# EAGLE design loads (EAGLE 6.6.0)
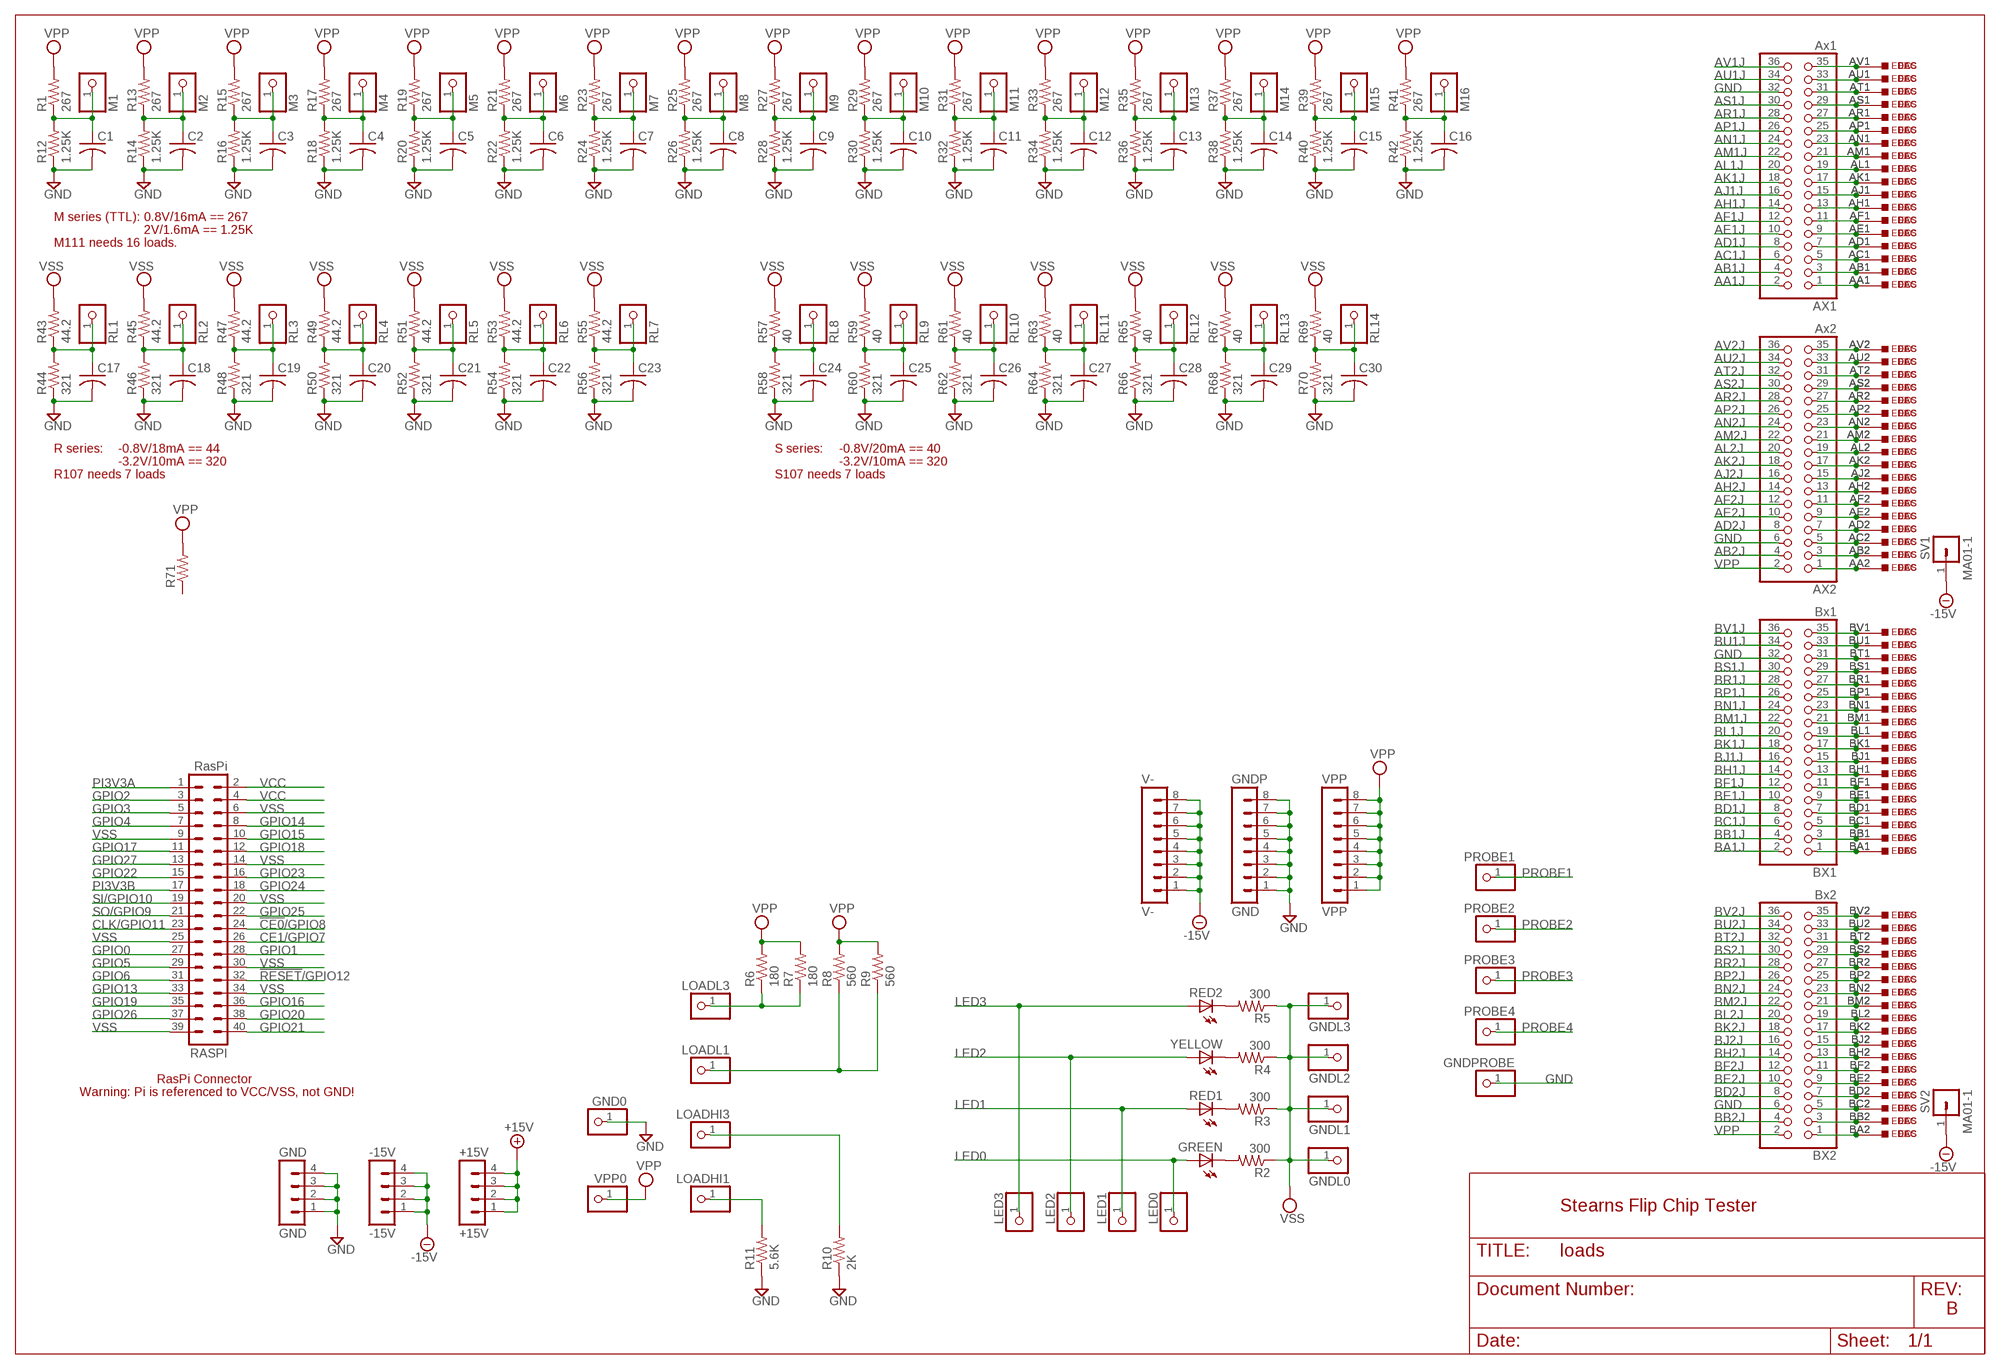
[diagram p0: schematic, sheet 1]

## Parts
+15V  +15V  MA04-1  [MA04-1]
-15V  -15V  MA04-1  [MA04-1]
AX1  Ax1  PINHD-2X18  [2X18]
AX2  Ax2  PINHD-2X18  [2X18]
BX1  Bx1  PINHD-2X18  [2X18]
BX2  Bx2  PINHD-2X18  [2X18]
C1  C-US025-025X050  [C025-025X050]
C2  C-US025-025X050  [C025-025X050]
C3  C-US025-025X050  [C025-025X050]
C4  C-US025-025X050  [C025-025X050]
C5  C-US025-025X050  [C025-025X050]
C6  C-US025-025X050  [C025-025X050]
C7  C-US025-025X050  [C025-025X050]
C8  C-US025-025X050  [C025-025X050]
C9  C-US025-025X050  [C025-025X050]
C10  C-US025-025X050  [C025-025X050]
C11  C-US025-025X050  [C025-025X050]
C12  C-US025-025X050  [C025-025X050]
C13  C-US025-025X050  [C025-025X050]
C14  C-US025-025X050  [C025-025X050]
C15  C-US025-025X050  [C025-025X050]
C16  C-US025-025X050  [C025-025X050]
C17  C-US025-025X050  [C025-025X050]
C18  C-US025-025X050  [C025-025X050]
C19  C-US025-025X050  [C025-025X050]
C20  C-US025-025X050  [C025-025X050]
C21  C-US025-025X050  [C025-025X050]
C22  C-US025-025X050  [C025-025X050]
C23  C-US025-025X050  [C025-025X050]
C24  C-US025-025X050  [C025-025X050]
C25  C-US025-025X050  [C025-025X050]
C26  C-US025-025X050  [C025-025X050]
C27  C-US025-025X050  [C025-025X050]
C28  C-US025-025X050  [C025-025X050]
C29  C-US025-025X050  [C025-025X050]
C30  C-US025-025X050  [C025-025X050]
DEC  W971  [H807-2]
ECS  W971ECS  [ECS2418-2]
EDAC  W971EDAC  [EDAC346-36-2]
GND  GND  MA04-1  [MA04-1]
GND0  PINHD-1X1  [1X01]
GNDL0  PINHD-1X1  [1X01]
GNDL1  PINHD-1X1  [1X01]
GNDL2  PINHD-1X1  [1X01]
GNDL3  PINHD-1X1  [1X01]
GNDP  GND  MA08-1  [MA08-1]
GNDPROBE  PINHD-1X1  [1X01]
GREEN  LED5MM  [LED5MM]
LED0  PINHD-1X1  [1X01]
LED1  PINHD-1X1  [1X01]
LED2  PINHD-1X1  [1X01]
LED3  PINHD-1X1  [1X01]
LOADHI1  PINHD-1X1  [1X01]
LOADHI3  PINHD-1X1  [1X01]
LOADL1  PINHD-1X1  [1X01]
LOADL3  PINHD-1X1  [1X01]
M1  PINHD-1X1  [1X01]
M2  PINHD-1X1  [1X01]
M3  PINHD-1X1  [1X01]
M4  PINHD-1X1  [1X01]
M5  PINHD-1X1  [1X01]
M6  PINHD-1X1  [1X01]
M7  PINHD-1X1  [1X01]
M8  PINHD-1X1  [1X01]
M9  PINHD-1X1  [1X01]
M10  PINHD-1X1  [1X01]
M11  PINHD-1X1  [1X01]
M12  PINHD-1X1  [1X01]
M13  PINHD-1X1  [1X01]
M14  PINHD-1X1  [1X01]
M15  PINHD-1X1  [1X01]
M16  PINHD-1X1  [1X01]
PROBE1  PINHD-1X1  [1X01]
PROBE2  PINHD-1X1  [1X01]
PROBE3  PINHD-1X1  [1X01]
PROBE4  PINHD-1X1  [1X01]
R1  267  R-US_0207/10  [0207/10]
R2  300  R-US_0207/10  [0207/10]
R3  300  R-US_0207/10  [0207/10]
R4  300  R-US_0207/10  [0207/10]
R5  300  R-US_0207/10  [0207/10]
R6  180  R-US_0207/10  [0207/10]
R7  180  R-US_0207/10  [0207/10]
R8  560  R-US_0207/10  [0207/10]
R9  560  R-US_0207/10  [0207/10]
R10  2K  R-US_0207/10  [0207/10]
R11  5.6K  R-US_0207/10  [0207/10]
R12  1.25K  R-US_0207/10  [0207/10]
R13  267  R-US_0207/10  [0207/10]
R14  1.25K  R-US_0207/10  [0207/10]
R15  267  R-US_0207/10  [0207/10]
R16  1.25K  R-US_0207/10  [0207/10]
R17  267  R-US_0207/10  [0207/10]
R18  1.25K  R-US_0207/10  [0207/10]
R19  267  R-US_0207/10  [0207/10]
R20  1.25K  R-US_0207/10  [0207/10]
R21  267  R-US_0207/10  [0207/10]
R22  1.25K  R-US_0207/10  [0207/10]
R23  267  R-US_0207/10  [0207/10]
R24  1.25K  R-US_0207/10  [0207/10]
R25  267  R-US_0207/10  [0207/10]
R26  1.25K  R-US_0207/10  [0207/10]
R27  267  R-US_0207/10  [0207/10]
R28  1.25K  R-US_0207/10  [0207/10]
R29  267  R-US_0207/10  [0207/10]
R30  1.25K  R-US_0207/10  [0207/10]
R31  267  R-US_0207/10  [0207/10]
R32  1.25K  R-US_0207/10  [0207/10]
R33  267  R-US_0207/10  [0207/10]
R34  1.25K  R-US_0207/10  [0207/10]
R35  267  R-US_0207/10  [0207/10]
R36  1.25K  R-US_0207/10  [0207/10]
R37  267  R-US_0207/10  [0207/10]
R38  1.25K  R-US_0207/10  [0207/10]
R39  267  R-US_0207/10  [0207/10]
R40  1.25K  R-US_0207/10  [0207/10]
R41  267  R-US_0207/10  [0207/10]
R42  1.25K  R-US_0207/10  [0207/10]
R43  44.2  R-US_0207/10  [0207/10]
R44  321  R-US_0207/10  [0207/10]
R45  44.2  R-US_0207/10  [0207/10]
R46  321  R-US_0207/10  [0207/10]
R47  44.2  R-US_0207/10  [0207/10]
R48  321  R-US_0207/10  [0207/10]
R49  44.2  R-US_0207/10  [0207/10]
R50  321  R-US_0207/10  [0207/10]
R51  44.2  R-US_0207/10  [0207/10]
R52  321  R-US_0207/10  [0207/10]
R53  44.2  R-US_0207/10  [0207/10]
R54  321  R-US_0207/10  [0207/10]
R55  44.2  R-US_0207/10  [0207/10]
R56  321  R-US_0207/10  [0207/10]
R57  40  R-US_0207/10  [0207/10]
R58  321  R-US_0207/10  [0207/10]
R59  40  R-US_0207/10  [0207/10]
R60  321  R-US_0207/10  [0207/10]
R61  40  R-US_0207/10  [0207/10]
R62  321  R-US_0207/10  [0207/10]
R63  40  R-US_0207/10  [0207/10]
R64  321  R-US_0207/10  [0207/10]
R65  40  R-US_0207/10  [0207/10]
R66  321  R-US_0207/10  [0207/10]
R67  40  R-US_0207/10  [0207/10]
R68  321  R-US_0207/10  [0207/10]
R69  40  R-US_0207/10  [0207/10]
R70  321  R-US_0207/10  [0207/10]
R71  R-US_0207/10  [0207/10]
RASPI  RasPi  MA20-2  [MA20-2]
RED1  LED5MM  [LED5MM]
RED2  LED5MM  [LED5MM]
RL1  PINHD-1X1  [1X01]
RL2  PINHD-1X1  [1X01]
RL3  PINHD-1X1  [1X01]
RL4  PINHD-1X1  [1X01]
RL5  PINHD-1X1  [1X01]
RL6  PINHD-1X1  [1X01]
RL7  PINHD-1X1  [1X01]
RL8  PINHD-1X1  [1X01]
RL9  PINHD-1X1  [1X01]
RL10  PINHD-1X1  [1X01]
RL11  PINHD-1X1  [1X01]
RL12  PINHD-1X1  [1X01]
RL13  PINHD-1X1  [1X01]
RL14  PINHD-1X1  [1X01]
SV1  MA01-1  [MA01-1]
SV2  MA01-1  [MA01-1]
V-  V-  MA08-1  [MA08-1]
VPP  VPP  MA08-1  [MA08-1]
VPP0  PINHD-1X1  [1X01]
YELLOW  LED5MM  [LED5MM]

## Nets
!CE0!/GPIO8: RASPI.24
!RESET!/GPIO12: RASPI.32
+15V [Supply]: +15V.1 +15V.2 +15V.3 +15V.4
-15V [Supply]: -15V.1 -15V.2 -15V.3 -15V.4 SV1.1 SV2.1 V-.1 V-.2 V-.3 V-.4 V-.5 V-.6 V-.7 V-.8
AA1J: AX1.2
AB1J: AX1.4
AB2J [Supply]: AX2.4
AC1J: AX1.6
AD1J: AX1.8
AD2J: AX2.8
AE1J: AX1.10
AE2J: AX2.10
AF1J: AX1.12
AF2J: AX2.12
AH1J: AX1.14
AH2J: AX2.14
AJ1J: AX1.16
AJ2J: AX2.16
AK1J: AX1.18
AK2J: AX2.18
AL1J: AX1.20
AL2J: AX2.20
AM1J: AX1.22
AM2J: AX2.22
AN1J: AX1.24
AN2J: AX2.24
AP1J: AX1.26
AP2J: AX2.26
AR1J: AX1.28
AR2J: AX2.28
AS1J: AX1.30
AS2J: AX2.30
AT2J: AX2.32
AU1J: AX1.34
AU2J: AX2.34
AV1J: AX1.36
AV2J: AX2.36
BA1J: BX1.2
BB1J: BX1.4
BB2J: BX2.4
BC1J: BX1.6
BD1J: BX1.8
BD2J: BX2.8
BE1J: BX1.10
BE2J: BX2.10
BF1J: BX1.12
BF2J: BX2.12
BH1J: BX1.14
BH2J: BX2.14
BJ1J: BX1.16
BJ2J: BX2.16
BK1J: BX1.18
BK2J: BX2.18
BL1J: BX1.20
BL2J: BX2.20
BM1J: BX1.22
BM2J: BX2.22
BN1J: BX1.24
BN2J: BX2.24
BP1J: BX1.26
BP2J: BX2.26
BR1J: BX1.28
BR2J: BX2.28
BS1J: BX1.30
BS2J: BX2.30
BT2J: BX2.32
BU1J: BX1.34
BU2J: BX2.34
BV1J: BX1.36
BV2J: BX2.36
CE1/GPIO7: RASPI.26
CLK/GPIO11: RASPI.23
GND [Supply]: AX1.32 AX2.6 BX1.32 BX2.6 C1.2 C2.2 C3.2 C4.2 C5.2 C6.2 C7.2 C8.2 C9.2 C10.2 C11.2 C12.2 C13.2 C14.2 C15.2 C16.2 C17.2 C18.2 C19.2 C20.2 C21.2 C22.2 C23.2 C24.2 C25.2 C26.2 C27.2 C28.2 C29.2 C30.2 GND0.1 GND.1 GND.2 GND.3 GND.4 GNDP.1 GNDP.2 GNDP.3 GNDP.4 GNDP.5 GNDP.6 GNDP.7 GNDP.8 GNDPROBE.1 R10.1 R11.1 R12.1 R14.1 R16.1 R18.1 R20.1 R22.1 R24.1 R26.1 R28.1 R30.1 R32.1 R34.1 R36.1 R38.1 R40.1 R42.1 R44.1 R46.1 R48.1 R50.1 R52.1 R54.1 R56.1 R58.1 R60.1 R62.1 R64.1 R66.1 R68.1 R70.1
GPIO0: RASPI.27
GPIO1: RASPI.28
GPIO2: RASPI.3
GPIO3: RASPI.5
GPIO4: RASPI.7
GPIO5: RASPI.29
GPIO6: RASPI.31
GPIO13: RASPI.33
GPIO14: RASPI.8
GPIO15: RASPI.10
GPIO16: RASPI.36
GPIO17: RASPI.11
GPIO18: RASPI.12
GPIO19: RASPI.35
GPIO20: RASPI.38
GPIO21: RASPI.40
GPIO22: RASPI.15
GPIO23: RASPI.16
GPIO24: RASPI.18
GPIO25: RASPI.22
GPIO26: RASPI.37
GPIO27: RASPI.13
LED0: GREEN.A LED0.1
LED1: LED1.1 RED1.A
LED2: LED2.1 YELLOW.A
LED3: LED3.1 RED2.A
N$1: AX1.1 DEC.AA1 ECS.AA1 EDAC.AA1
N$2: AX1.35 DEC.AV1 ECS.AV1 EDAC.AV1
N$3: AX1.33 DEC.AU1 ECS.AU1 EDAC.AU1
N$4: AX1.31 DEC.AT1 ECS.AT1 EDAC.AT1
N$5: AX1.29 DEC.AS1 ECS.AS1 EDAC.AS1
N$6: AX1.27 DEC.AR1 ECS.AR1 EDAC.AR1
N$7: AX1.25 DEC.AP1 ECS.AP1 EDAC.AP1
N$8: AX1.23 DEC.AN1 ECS.AN1 EDAC.AN1
N$9: AX1.21 DEC.AM1 ECS.AM1 EDAC.AM1
N$10: AX1.19 DEC.AL1 ECS.AL1 EDAC.AL1
N$11: AX1.17 DEC.AK1 ECS.AK1 EDAC.AK1
N$12: AX1.15 DEC.AJ1 ECS.AJ1 EDAC.AJ1
N$13: AX1.13 DEC.AH1 ECS.AH1 EDAC.AH1
N$14: AX1.11 DEC.AF1 ECS.AF1 EDAC.AF1
N$15: AX1.9 DEC.AE1 ECS.AE1 EDAC.AE1
N$16: AX1.7 DEC.AD1 ECS.AD1 EDAC.AD1
N$17: AX1.5 DEC.AC1 ECS.AC1 EDAC.AC1
N$18: AX1.3 DEC.AB1 ECS.AB1 EDAC.AB1
N$19: AX2.1 DEC.AA2 ECS.AA2 EDAC.AA2
N$20: AX2.3 DEC.AB2 ECS.AB2 EDAC.AB2
N$21: AX2.5 DEC.AC2 ECS.AC2 EDAC.AC2
N$22: AX2.7 DEC.AD2 ECS.AD2 EDAC.AD2
N$23: AX2.9 DEC.AE2 ECS.AE2 EDAC.AE2
N$24: AX2.11 DEC.AF2 ECS.AF2 EDAC.AF2
N$25: AX2.13 DEC.AH2 ECS.AH2 EDAC.AH2
N$26: AX2.15 DEC.AJ2 ECS.AJ2 EDAC.AJ2
N$27: AX2.17 DEC.AK2 ECS.AK2 EDAC.AK2
N$28: AX2.19 DEC.AL2 ECS.AL2 EDAC.AL2
N$29: AX2.21 DEC.AM2 ECS.AM2 EDAC.AM2
N$30: AX2.23 DEC.AN2 ECS.AN2 EDAC.AN2
N$31: AX2.25 DEC.AP2 ECS.AP2 EDAC.AP2
N$32: AX2.27 DEC.AR2 ECS.AR2 EDAC.AR2
N$33: AX2.29 DEC.AS2 ECS.AS2 EDAC.AS2
N$34: AX2.31 DEC.AT2 ECS.AT2 EDAC.AT2
N$35: AX2.33 DEC.AU2 ECS.AU2 EDAC.AU2
N$36: AX2.35 DEC.AV2 ECS.AV2 EDAC.AV2
N$37: BX2.1 DEC.BA2 ECS.BA2 EDAC.BA2
N$38: BX2.3 DEC.BB2 ECS.BB2 EDAC.BB2
N$39: BX2.5 DEC.BC2 ECS.BC2 EDAC.BC2
N$40: BX2.7 DEC.BD2 ECS.BD2 EDAC.BD2
N$41: BX2.9 DEC.BE2 ECS.BE2 EDAC.BE2
N$42: BX2.11 DEC.BF2 ECS.BF2 EDAC.BF2
N$43: BX2.13 DEC.BH2 ECS.BH2 EDAC.BH2
N$44: BX2.15 DEC.BJ2 ECS.BJ2 EDAC.BJ2
N$45: BX2.17 DEC.BK2 ECS.BK2 EDAC.BK2
N$46: BX2.19 DEC.BL2 ECS.BL2 EDAC.BL2
N$47: BX2.21 DEC.BM2 ECS.BM2 EDAC.BM2
N$48: BX2.23 DEC.BN2 ECS.BN2 EDAC.BN2
N$49: BX2.25 DEC.BP2 ECS.BP2 EDAC.BP2
N$50: BX2.27 DEC.BR2 ECS.BR2 EDAC.BR2
N$51: BX2.29 DEC.BS2 ECS.BS2 EDAC.BS2
N$52: BX2.31 DEC.BT2 ECS.BT2 EDAC.BT2
N$53: BX2.33 DEC.BU2 ECS.BU2 EDAC.BU2
N$54: BX2.35 DEC.BV2 ECS.BV2 EDAC.BV2
N$55: BX1.1 DEC.BA1 ECS.BA1 EDAC.BA1
N$56: BX1.3 DEC.BB1 ECS.BB1 EDAC.BB1
N$57: BX1.5 DEC.BC1 ECS.BC1 EDAC.BC1
N$58: BX1.7 DEC.BD1 ECS.BD1 EDAC.BD1
N$59: BX1.9 DEC.BE1 ECS.BE1 EDAC.BE1
N$60: BX1.11 DEC.BF1 ECS.BF1 EDAC.BF1
N$61: BX1.13 DEC.BH1 ECS.BH1 EDAC.BH1
N$62: BX1.15 DEC.BJ1 ECS.BJ1 EDAC.BJ1
N$63: BX1.17 DEC.BK1 ECS.BK1 EDAC.BK1
N$64: BX1.19 DEC.BL1 ECS.BL1 EDAC.BL1
N$65: BX1.21 DEC.BM1 ECS.BM1 EDAC.BM1
N$66: BX1.23 DEC.BN1 ECS.BN1 EDAC.BN1
N$67: BX1.25 DEC.BP1 ECS.BP1 EDAC.BP1
N$68: BX1.27 DEC.BR1 ECS.BR1 EDAC.BR1
N$69: BX1.29 DEC.BS1 ECS.BS1 EDAC.BS1
N$70: BX1.31 DEC.BT1 ECS.BT1 EDAC.BT1
N$71: BX1.33 DEC.BU1 ECS.BU1 EDAC.BU1
N$72: BX1.35 DEC.BV1 ECS.BV1 EDAC.BV1
N$73: GREEN.K(C) R2.2
N$74: R3.2 RED1.K(C)
N$75: R4.2 YELLOW.K(C)
N$76: R5.2 RED2.K(C)
N$77: LOADL3.1 R6.1 R7.1
N$78: LOADL1.1 R8.1 R9.1
N$79: LOADHI1.1 R11.2
N$80: LOADHI3.1 R10.2
N$81: C1.1 M1.1 R1.1 R12.2
N$82: C2.1 M2.1 R13.1 R14.2
N$83: C3.1 M3.1 R15.1 R16.2
N$84: C4.1 M4.1 R17.1 R18.2
N$85: C5.1 M5.1 R19.1 R20.2
N$86: C6.1 M6.1 R21.1 R22.2
N$87: C7.1 M7.1 R23.1 R24.2
N$88: C8.1 M8.1 R25.1 R26.2
N$89: C9.1 M9.1 R27.1 R28.2
N$90: C10.1 M10.1 R29.1 R30.2
N$91: C11.1 M11.1 R31.1 R32.2
N$92: C12.1 M12.1 R33.1 R34.2
N$93: C13.1 M13.1 R35.1 R36.2
N$94: C14.1 M14.1 R37.1 R38.2
N$95: C15.1 M15.1 R39.1 R40.2
N$96: C16.1 M16.1 R41.1 R42.2
N$97: C17.1 R43.1 R44.2 RL1.1
N$98: C18.1 R45.1 R46.2 RL2.1
N$99: C19.1 R47.1 R48.2 RL3.1
N$100: C20.1 R49.1 R50.2 RL4.1
N$101: C21.1 R51.1 R52.2 RL5.1
N$102: C22.1 R53.1 R54.2 RL6.1
N$103: C23.1 R55.1 R56.2 RL7.1
N$104: C24.1 R57.1 R58.2 RL8.1
N$105: C25.1 R59.1 R60.2 RL9.1
N$106: C26.1 R61.1 R62.2 RL10.1
N$107: C27.1 R63.1 R64.2 RL11.1
N$108: C28.1 R65.1 R66.2 RL12.1
N$109: C29.1 R67.1 R68.2 RL13.1
N$110: C30.1 R69.1 R70.2 RL14.1
PI3V3A: RASPI.1
PI3V3B: RASPI.17
PROBE1: PROBE1.1
PROBE2: PROBE2.1
PROBE3: PROBE3.1
PROBE4: PROBE4.1
SI/GPIO10: RASPI.19
SO/GPIO9: RASPI.21
VCC [Supply]: RASPI.2 RASPI.4
VPP [Supply]: AX2.2 BX2.2 R1.2 R6.2 R7.2 R8.2 R9.2 R13.2 R15.2 R17.2 R19.2 R21.2 R23.2 R25.2 R27.2 R29.2 R31.2 R33.2 R35.2 R37.2 R39.2 R41.2 R71.2 VPP0.1 VPP.1 VPP.2 VPP.3 VPP.4 VPP.5 VPP.6 VPP.7 VPP.8
VSS [Supply]: GNDL0.1 GNDL1.1 GNDL2.1 GNDL3.1 R2.1 R3.1 R4.1 R5.1 R43.2 R45.2 R47.2 R49.2 R51.2 R53.2 R55.2 R57.2 R59.2 R61.2 R63.2 R65.2 R67.2 R69.2 RASPI.6 RASPI.9 RASPI.14 RASPI.20 RASPI.25 RASPI.30 RASPI.34 RASPI.39
Unconnected: R71.1

## Notes on the sheet
- M series (TTL): | 0.8V/16mA == 267
- 2V/1.6mA == 1.25K
- M111 needs 16 loads.
- R series: | -0.8V/18mA == 44 | S series: | -0.8V/20mA == 40
- -3.2V/10mA == 320 | -3.2V/10mA == 320
- R107 needs 7 loads | S107 needs 7 loads
- RasPi Connector
- Warning: Pi is referenced to VCC/VSS, not GND!
- Stearns Flip Chip Tester
- B

## Library data of the parts
+15V -15V GND = con-lstb:MA04-1: PIN HEADER; OC_FARNELL: unknown; OC_NEWARK: unknown
AX1 AX2 BX1 BX2 = pinhead:PINHD-2X18: PIN HEADER
C1-C30 = rcl:C-US: CAPACITOR, American symbol
DEC ECS EDAC = dec-m:W971: Double sided Double Height Connector, 72 pins
GND0 GNDL0 GNDL1-GNDL3 GNDPROBE LED0 LED1-LED3 LOADHI1 LOADHI3 LOADL1 LOADL3 M1-M16 PROBE1-PROBE4 RL1-RL14 VPP0 = pinhead:PINHD-1X1: PIN HEADER
GNDP V- VPP = con-lstb:MA08-1: PIN HEADER; OC_FARNELL: unknown; OC_NEWARK: unknown
GREEN RED1 RED2 YELLOW = led:LED: LED OSRAM: - CHIPLED LG R971, LG N971, LY N971, LG Q971, LY Q971, LO R971, LY R971 LH N974, LH R974 LS Q976, LO Q976, LY Q976 LO Q996 - Hyper CHIPLED LW Q18S LB Q993, LB Q99A, LB R99A - SideLED LS A670, LO A670, LY A670, LG A670, LP A670 LB A673, LV A673, LT A673, LW A673 LH A674 LY A675 LS A676, LA A676, LO A676, LY A676, LW A676 LS A679, LY A679, LG A679 - Hyper Micro SIDELED® LS Y876, LA Y876, LO Y876, LY Y876 LT Y87S - SmartLED LW L88C, LW L88S LB L89C, LB L89S, LG L890 LS L89K, LO L89K, LY L89K LS L896, LA L896, LO L896, LY L896 - TOPLED LS T670, LO T670, LY T670, LG T670, LP T670 LSG T670, LSP T670, LSY T670, LOP T670, LYG T670 LG T671, LOG T671, LSG T671 LB T673, LV T673, LT T673, LW T673 LH T674 LS T676, LA T676, LO T676, LY T676, LB T676, LH T676, LSB T676, LW T676 LB T67C, LV T67C, LT T67C, LS T67K, LO T67K, LY T67K, LW E67C LS E67B, LA E67B, LO E67B, LY E67B, LB E67C, LV E67C, LT E67C LW T67C LS T679, LY T679, LG T679 LS T770, LO T770, LY T770, LG T770, LP T770 LB T773, LV T773, LT T773, LW T773 LH T774 LS E675, LA E675, LY E675, LS T675 LS T776, LA T776, LO T776, LY T776, LB T776 LHGB T686 LT T68C, LB T68C - Hyper Mini TOPLED® LB M676 - Mini TOPLED Santana® LG M470 LS M47K, LO M47K, LY M47K Source: http://www.osram.convergy.de LUXEON: - LUMILED® LXK2-PW12-R00, LXK2-PW12-S00, LXK2-PW14-U00, LXK2-PW14-V00 LXK2-PM12-R00, LXK2-PM12-S00, LXK2-PM14-U00 LXK2-PE12-Q00, LXK2-PE12-R00, LXK2-PE12-S00, LXK2-PE14-T00, LXK2-PE14-U00 LXK2-PB12-K00, LXK2-PB12-L00, LXK2-PB12-M00, LXK2-PB14-N00, LXK2-PB14-P00, LXK2-PB14-Q00 LXK2-PR12-L00, LXK2-PR12-M00, LXK2-PR14-Q00, LXK2-PR14-R00 LXK2-PD12-Q00, LXK2-PD12-R00, LXK2-PD12-S00 LXK2-PH12-R00, LXK2-PH12-S00 LXK2-PL12-P00, LXK2-PL12-Q00, LXK2-PL12-R00 Source: www.luxeon.com KINGBRIGHT: KA-3528ASYC Source: www.kingbright.com
R1-R71 = rcl:R-US_: RESISTOR, American symbol
RASPI = con-lstb:MA20-2: PIN HEADER; OC_FARNELL: unknown; OC_NEWARK: unknown
SV1 SV2 = dec-con:MA01-1: Pin Header (.125" spacing)

## Net classes
1 Supply: width 0.813 mm

## Board
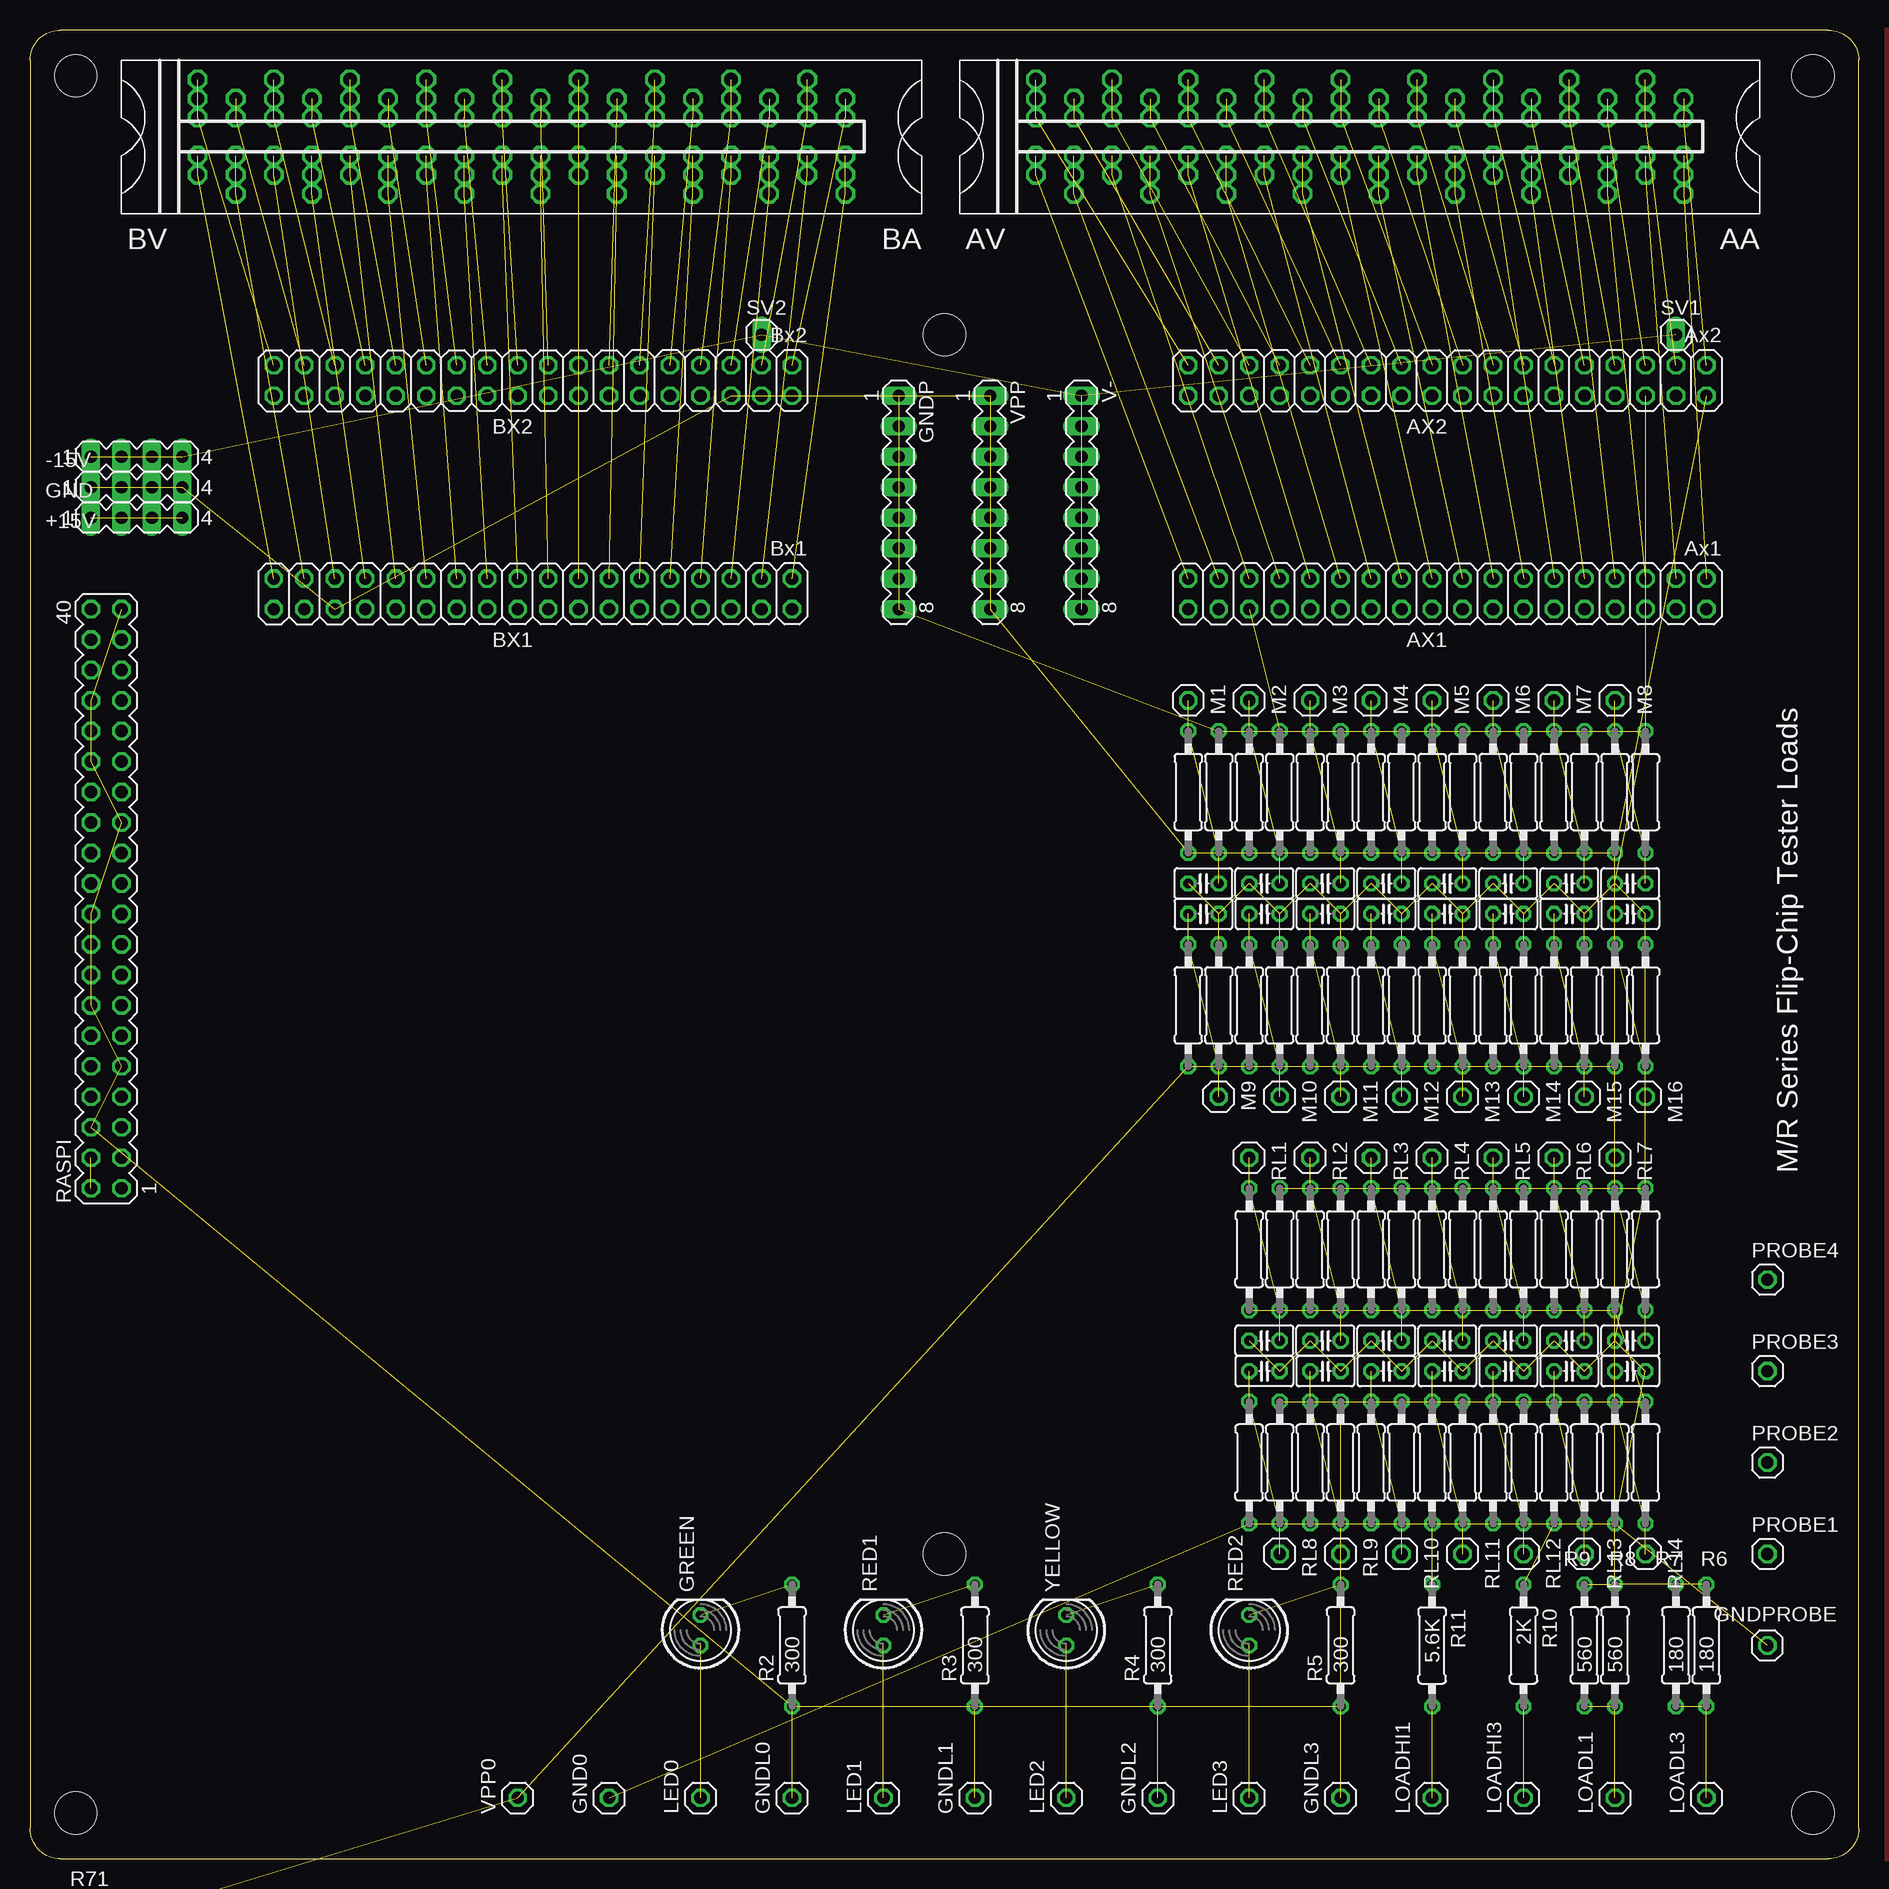
[diagram p1: board, top side]
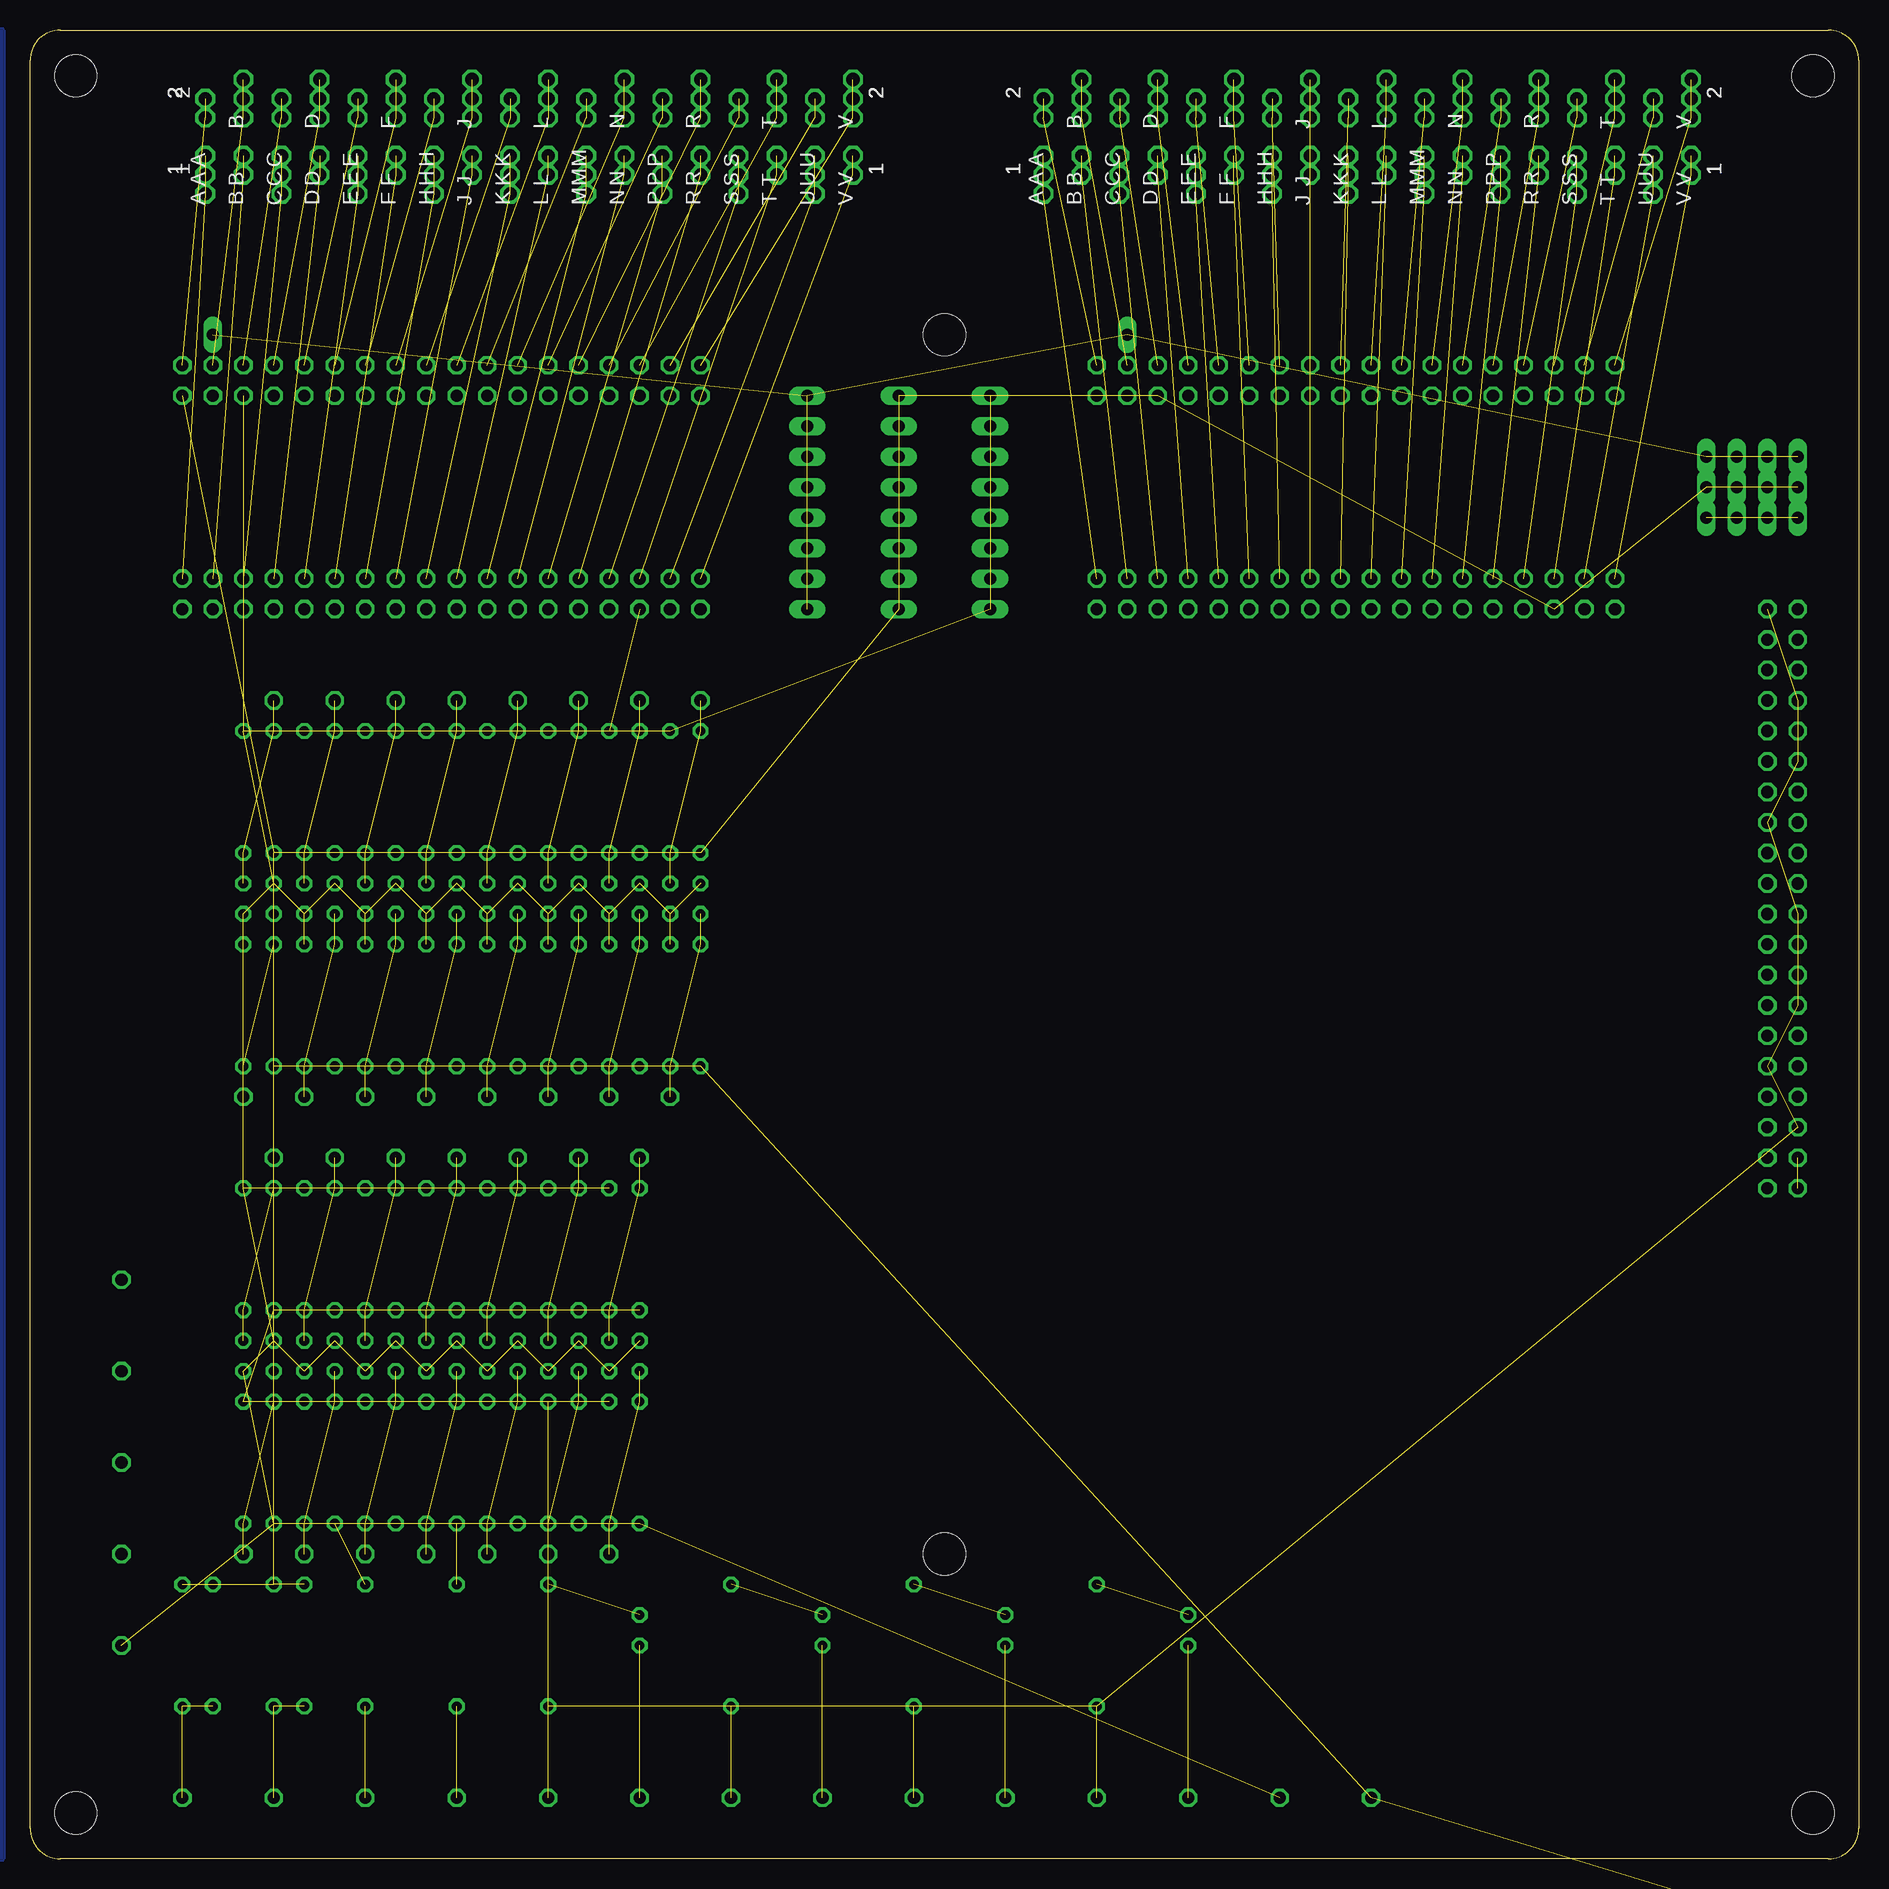
[diagram p2: board, bottom side, seen from below]

Size 152.4 x 152.4 mm. Coordinates in mm from the lower left corner, seen from the top.
Outline: 149.86,152.4 2.54,152.4 arc90 0,149.86 0,2.54 arc90 2.54,0 149.86,0 arc90 152.4,2.54 152.4,149.86 arc90 149.86,152.4
Copper layers (1+16): Top 0.035mm / dielectric 1.5mm / Bottom 0.035mm
Design rules "16mils *": minimum track width 16mil, minimum drill 32mil, track to track 15mil, track to pad 10mil, pad to pad 10mil, via to via 10mil, smd to smd 10mil, copper to edge 13mil, drill to drill 10mil, minimum pad ring 10mil, minimum via ring 8mil, stop-mask expansion 0mil, vias tented up to drill 0mil, thermal gap 10mil
Holes 3.51 mm at 148.59,148.59 3.81,148.59 3.81,3.81 148.59,3.81 76.2,127 76.2,25.4
vRestrict: area 144.8,57.1 to 147.3,94

### Footprints (pad centres in the part's own frame; a part is rotated, then mirrored left to right if it is on the bottom)
MA04-1 = drill 1.016 long: 1 -3.81,0; 2 -1.27,0; 3 1.27,0; 4 3.81,0
2X18 = drill 1.016 octagon: 1 -21.59,-1.27; 2 -21.59,1.27; 3 -19.05,-1.27; 4 -19.05,1.27; 5 -16.51,-1.27; 6 -16.51,1.27; 7 -13.97,-1.27; 8 -13.97,1.27; 9 -11.43,-1.27; 10 -11.43,1.27; 11 -8.89,-1.27; 12 -8.89,1.27; 13 -6.35,-1.27; 14 -6.35,1.27; 15 -3.81,-1.27; 16 -3.81,1.27; 17 -1.27,-1.27; 18 -1.27,1.27; 19 1.27,-1.27; 20 1.27,1.27; 21 3.81,-1.27; 22 3.81,1.27; 23 6.35,-1.27; 24 6.35,1.27; 25 8.89,-1.27; 26 8.89,1.27; 27 11.43,-1.27; 28 11.43,1.27; 29 13.97,-1.27; 30 13.97,1.27; 31 16.51,-1.27; 32 16.51,1.27; 33 19.05,-1.27; 34 19.05,1.27; 35 21.59,-1.27; 36 21.59,1.27
C025-025X050 = drill 0.813 octagon: 1 -1.27,0; 2 1.27,0
H807-2 = drill 1.092 octagon: AA1 4.763,60.325; AA2 -1.587,60.325; AB1 1.587,57.15; AB2 -4.763,57.15; AC1 4.763,53.975; AC2 -1.587,53.975; AD1 1.587,50.8; AD2 -4.763,50.8; AE1 4.763,47.625; AE2 -1.587,47.625; AF1 1.587,44.45; AF2 -4.763,44.45; AH1 4.763,41.275; AH2 -1.587,41.275; AJ1 1.587,38.1; AJ2 -4.763,38.1; AK1 4.763,34.925; AK2 -1.587,34.925; AL1 1.587,31.75; AL2 -4.763,31.75; AM1 4.763,28.575; AM2 -1.587,28.575; AN1 1.587,25.4; AN2 -4.763,25.4; AP1 4.763,22.225; AP2 -1.587,22.225; AR1 1.587,19.05; AR2 -4.763,19.05; AS1 4.763,15.875; AS2 -1.587,15.875; AT1 1.587,12.7; AT2 -4.763,12.7; AU1 4.763,9.525; AU2 -1.587,9.525; AV1 1.587,6.35; AV2 -4.763,6.35; BA1 4.763,-9.525; BA2 -1.587,-9.525; BB1 1.587,-12.7; BB2 -4.763,-12.7; BC1 4.763,-15.875; BC2 -1.587,-15.875; BD1 1.587,-19.05; BD2 -4.763,-19.05; BE1 4.763,-22.225; BE2 -1.587,-22.225; BF1 1.587,-25.4; BF2 -4.763,-25.4; BH1 4.763,-28.575; BH2 -1.587,-28.575; BJ1 1.587,-31.75; BJ2 -4.763,-31.75; BK1 4.763,-34.925; BK2 -1.587,-34.925; BL1 1.587,-38.1; BL2 -4.763,-38.1; BM1 4.763,-41.275; BM2 -1.587,-41.275; BN1 1.587,-44.45; BN2 -4.763,-44.45; BP1 4.763,-47.625; BP2 -1.587,-47.625; BR1 1.587,-50.8; BR2 -4.763,-50.8; BS1 4.763,-53.975; BS2 -1.587,-53.975; BT1 1.587,-57.15; BT2 -4.763,-57.15; BU1 4.763,-60.325; BU2 -1.587,-60.325; BV1 1.587,-63.5; BV2 -4.763,-63.5
ECS2418-2 = drill 1.092 octagon: AA1 1.587,60.325; AA2 -1.587,60.325; AB1 1.587,57.15; AB2 -1.587,57.15; AC1 1.587,53.975; AC2 -1.587,53.975; AD1 1.587,50.8; AD2 -1.587,50.8; AE1 1.587,47.625; AE2 -1.587,47.625; AF1 1.587,44.45; AF2 -1.587,44.45; AH1 1.587,41.275; AH2 -1.587,41.275; AJ1 1.587,38.1; AJ2 -1.587,38.1; AK1 1.587,34.925; AK2 -1.587,34.925; AL1 1.587,31.75; AL2 -1.587,31.75; AM1 1.587,28.575; AM2 -1.587,28.575; AN1 1.587,25.4; AN2 -1.587,25.4; AP1 1.587,22.225; AP2 -1.587,22.225; AR1 1.587,19.05; AR2 -1.587,19.05; AS1 1.587,15.875; AS2 -1.587,15.875; AT1 1.587,12.7; AT2 -1.587,12.7; AU1 1.587,9.525; AU2 -1.587,9.525; AV1 1.587,6.35; AV2 -1.587,6.35; BA1 1.587,-9.525; BA2 -1.587,-9.525; BB1 1.587,-12.7; BB2 -1.587,-12.7; BC1 1.587,-15.875; BC2 -1.587,-15.875; BD1 1.587,-19.05; BD2 -1.587,-19.05; BE1 1.587,-22.225; BE2 -1.587,-22.225; BF1 1.587,-25.4; BF2 -1.587,-25.4; BH1 1.587,-28.575; BH2 -1.587,-28.575; BJ1 1.587,-31.75; BJ2 -1.587,-31.75; BK1 1.587,-34.925; BK2 -1.587,-34.925; BL1 1.587,-38.1; BL2 -1.587,-38.1; BM1 1.587,-41.275; BM2 -1.587,-41.275; BN1 1.587,-44.45; BN2 -1.587,-44.45; BP1 1.587,-47.625; BP2 -1.587,-47.625; BR1 1.587,-50.8; BR2 -1.587,-50.8; BS1 1.587,-53.975; BS2 -1.587,-53.975; BT1 1.587,-57.15; BT2 -1.587,-57.15; BU1 1.587,-60.325; BU2 -1.587,-60.325; BV1 1.587,-63.5; BV2 -1.587,-63.5
EDAC346-36-2 = drill 1.092 octagon: AA1 3.175,60.325; AA2 -3.175,60.325; AB1 3.175,57.15; AB2 -3.175,57.15; AC1 3.175,53.975; AC2 -3.175,53.975; AD1 3.175,50.8; AD2 -3.175,50.8; AE1 3.175,47.625; AE2 -3.175,47.625; AF1 3.175,44.45; AF2 -3.175,44.45; AH1 3.175,41.275; AH2 -3.175,41.275; AJ1 3.175,38.1; AJ2 -3.175,38.1; AK1 3.175,34.925; AK2 -3.175,34.925; AL1 3.175,31.75; AL2 -3.175,31.75; AM1 3.175,28.575; AM2 -3.175,28.575; AN1 3.175,25.4; AN2 -3.175,25.4; AP1 3.175,22.225; AP2 -3.175,22.225; AR1 3.175,19.05; AR2 -3.175,19.05; AS1 3.175,15.875; AS2 -3.175,15.875; AT1 3.175,12.7; AT2 -3.175,12.7; AU1 3.175,9.525; AU2 -3.175,9.525; AV1 3.175,6.35; AV2 -3.175,6.35; BA1 3.175,-9.525; BA2 -3.175,-9.525; BB1 3.175,-12.7; BB2 -3.175,-12.7; BC1 3.175,-15.875; BC2 -3.175,-15.875; BD1 3.175,-19.05; BD2 -3.175,-19.05; BE1 3.175,-22.225; BE2 -3.175,-22.225; BF1 3.175,-25.4; BF2 -3.175,-25.4; BH1 3.175,-28.575; BH2 -3.175,-28.575; BJ1 3.175,-31.75; BJ2 -3.175,-31.75; BK1 3.175,-34.925; BK2 -3.175,-34.925; BL1 3.175,-38.1; BL2 -3.175,-38.1; BM1 3.175,-41.275; BM2 -3.175,-41.275; BN1 3.175,-44.45; BN2 -3.175,-44.45; BP1 3.175,-47.625; BP2 -3.175,-47.625; BR1 3.175,-50.8; BR2 -3.175,-50.8; BS1 3.175,-53.975; BS2 -3.175,-53.975; BT1 3.175,-57.15; BT2 -3.175,-57.15; BU1 3.175,-60.325; BU2 -3.175,-60.325; BV1 3.175,-63.5; BV2 -3.175,-63.5
1X01 = drill 1.016 octagon: 1 0,0
MA08-1 = drill 1.016 long: 1 -8.89,0; 2 -6.35,0; 3 -3.81,0; 4 -1.27,0; 5 1.27,0; 6 3.81,0; 7 6.35,0; 8 8.89,0
LED5MM = drill 0.813 octagon: A -1.27,0; K 1.27,0
0207/10 = drill 0.813 octagon: 1 -5.08,0; 2 5.08,0
MA20-2 = drill 1.016 octagon: 1 -24.13,-1.27; 2 -24.13,1.27; 3 -21.59,-1.27; 4 -21.59,1.27; 5 -19.05,-1.27; 6 -19.05,1.27; 7 -16.51,-1.27; 8 -16.51,1.27; 9 -13.97,-1.27; 10 -13.97,1.27; 11 -11.43,-1.27; 12 -11.43,1.27; 13 -8.89,-1.27; 14 -8.89,1.27; 15 -6.35,-1.27; 16 -6.35,1.27; 17 -3.81,-1.27; 18 -3.81,1.27; 19 -1.27,-1.27; 20 -1.27,1.27; 21 1.27,-1.27; 22 1.27,1.27; 23 3.81,-1.27; 24 3.81,1.27; 25 6.35,-1.27; 26 6.35,1.27; 27 8.89,-1.27; 28 8.89,1.27; 29 11.43,-1.27; 30 11.43,1.27; 31 13.97,-1.27; 32 13.97,1.27; 33 16.51,-1.27; 34 16.51,1.27; 35 19.05,-1.27; 36 19.05,1.27; 37 21.59,-1.27; 38 21.59,1.27; 39 24.13,-1.27; 40 24.13,1.27
MA01-1 = drill 1.016 long: 1 0,0

### Placement (x,y rotation side)
+15V  8.89,111.76 0 top
-15V  8.89,116.84 0 top
AX1  118.11,105.41 180 top
AX2  118.11,123.19 180 top
BX1  41.91,105.41 180 top
BX2  41.91,123.19 180 top
C1  97.79,81.28 180 top
C2  102.87,81.28 180 top
C3  107.95,81.28 180 top
C4  113.03,81.28 180 top
C5  118.11,81.28 180 top
C6  123.19,81.28 180 top
C7  128.27,81.28 180 top
C8  133.35,81.28 180 top
C9  97.79,78.74 0 top
C10  102.87,78.74 0 top
C11  107.95,78.74 0 top
C12  113.03,78.74 0 top
C13  118.11,78.74 0 top
C14  123.19,78.74 0 top
C15  128.27,78.74 0 top
C16  133.35,78.74 0 top
C17  102.87,43.18 180 top
C18  107.95,43.18 180 top
C19  113.03,43.18 180 top
C20  118.11,43.18 180 top
C21  123.19,43.18 180 top
C22  128.27,43.18 180 top
C23  133.35,43.18 180 top
C24  102.87,40.64 0 top
C25  107.95,40.64 0 top
C26  113.03,40.64 0 top
C27  118.11,40.64 0 top
C28  123.19,40.64 0 top
C29  128.27,40.64 0 top
C30  133.35,40.64 0 top
DEC  77.47,143.51 270 top
ECS  77.47,143.51 270 top
EDAC  77.47,143.51 270 top
GND  8.89,114.3 0 top
GND0  48.26,5.08 90 top
GNDL0  63.5,5.08 90 top
GNDL1  78.74,5.08 90 top
GNDL2  93.98,5.08 90 top
GNDL3  109.22,5.08 90 top
GNDP  72.39,113.03 270 top
GNDPROBE  144.78,17.78 180 top
GREEN  55.88,19.05 90 top
LED0  55.88,5.08 90 top
LED1  71.12,5.08 90 top
LED2  86.36,5.08 90 top
LED3  101.6,5.08 90 top
LOADHI1  116.84,5.08 90 top
LOADHI3  124.46,5.08 90 top
LOADL1  132.08,5.08 90 top
LOADL3  139.7,5.08 90 top
M1  96.52,96.52 270 top
M2  101.6,96.52 270 top
M3  106.68,96.52 270 top
M4  111.76,96.52 270 top
M5  116.84,96.52 270 top
M6  121.92,96.52 270 top
M7  127,96.52 270 top
M8  132.08,96.52 270 top
M9  99.06,63.5 270 top
M10  104.14,63.5 270 top
M11  109.22,63.5 270 top
M12  114.3,63.5 270 top
M13  119.38,63.5 270 top
M14  124.46,63.5 270 top
M15  129.54,63.5 270 top
M16  134.62,63.5 270 top
PROBE1  144.78,25.4 0 top
PROBE2  144.78,33.02 0 top
PROBE3  144.78,40.64 0 top
PROBE4  144.78,48.26 0 top
R1  96.52,88.9 270 top
R2  63.5,17.78 90 top
R3  78.74,17.78 90 top
R4  93.98,17.78 90 top
R5  109.22,17.78 90 top
R6  139.7,17.78 90 top
R7  137.16,17.78 90 top
R8  132.08,17.78 90 top
R9  129.54,17.78 90 top
R10  124.46,17.78 270 top
R11  116.84,17.78 270 top
R12  99.06,88.9 270 top
R13  101.6,88.9 270 top
R14  104.14,88.9 270 top
R15  106.68,88.9 270 top
R16  109.22,88.9 270 top
R17  111.76,88.9 270 top
R18  114.3,88.9 270 top
R19  116.84,88.9 270 top
R20  119.38,88.9 270 top
R21  121.92,88.9 270 top
R22  124.46,88.9 270 top
R23  127,88.9 270 top
R24  129.54,88.9 270 top
R25  132.08,88.9 270 top
R26  134.62,88.9 270 top
R27  96.52,71.12 270 top
R28  99.06,71.12 270 top
R29  101.6,71.12 270 top
R30  104.14,71.12 270 top
R31  106.68,71.12 270 top
R32  109.22,71.12 270 top
R33  111.76,71.12 270 top
R34  114.3,71.12 270 top
R35  116.84,71.12 270 top
R36  119.38,71.12 270 top
R37  121.92,71.12 270 top
R38  124.46,71.12 270 top
R39  127,71.12 270 top
R40  129.54,71.12 270 top
R41  132.08,71.12 270 top
R42  134.62,71.12 270 top
R43  101.6,50.8 270 top
R44  104.14,50.8 270 top
R45  106.68,50.8 270 top
R46  109.22,50.8 270 top
R47  111.76,50.8 270 top
R48  114.3,50.8 270 top
R49  116.84,50.8 270 top
R50  119.38,50.8 270 top
R51  121.92,50.8 270 top
R52  124.46,50.8 270 top
R53  127,50.8 270 top
R54  129.54,50.8 270 top
R55  132.08,50.8 270 top
R56  134.62,50.8 270 top
R57  104.14,33.02 90 top
R58  101.6,33.02 90 top
R59  109.22,33.02 90 top
R60  106.68,33.02 90 top
R61  114.3,33.02 90 top
R62  111.76,33.02 90 top
R63  119.38,33.02 90 top
R64  116.84,33.02 90 top
R65  124.46,33.02 90 top
R66  121.92,33.02 90 top
R67  129.54,33.02 90 top
R68  127,33.02 90 top
R69  134.62,33.02 90 top
R70  132.08,33.02 90 top
R71  6.35,-3.81 0 top  (outside the outline)
RASPI  6.35,80.01 90 top
RED1  71.12,19.05 90 top
RED2  101.6,19.05 90 top
RL1  101.6,58.42 270 top
RL2  106.68,58.42 270 top
RL3  111.76,58.42 270 top
RL4  116.84,58.42 270 top
RL5  121.92,58.42 270 top
RL6  127,58.42 270 top
RL7  132.08,58.42 270 top
RL8  104.14,25.4 270 top
RL9  109.22,25.4 270 top
RL10  114.3,25.4 270 top
RL11  119.38,25.4 270 top
RL12  124.46,25.4 270 top
RL13  129.54,25.4 270 top
RL14  134.62,25.4 270 top
SV1  137.16,127 0 top
SV2  60.96,127 0 top
V-  87.63,113.03 270 top
VPP  80.01,113.03 270 top
VPP0  40.64,5.08 90 top
YELLOW  86.36,19.05 90 top

### Tracks (layer width: path | path; a pad name or v marks a point on that pad's centre or on a via)
+15V  (3 unrouted)
-15V  (13 unrouted)
GND  (79 unrouted)
  pour Bottom (isolate 0.406): 307.34,152.4 154.94,152.4 154.94,0 307.34,0
  pour Top (isolate 0.406): 307.34,152.4 154.94,152.4 154.94,0 307.34,0
LED0  (1 unrouted)
LED1  (1 unrouted)
LED2  (1 unrouted)
LED3  (1 unrouted)
N$1  (3 unrouted)
N$2  (2 unrouted)
N$3  (3 unrouted)
N$4  (2 unrouted)
N$5  (3 unrouted)
N$6  (2 unrouted)
N$7  (3 unrouted)
N$8  (2 unrouted)
N$9  (3 unrouted)
N$10  (2 unrouted)
N$11  (3 unrouted)
N$12  (2 unrouted)
N$13  (3 unrouted)
N$14  (2 unrouted)
N$15  (3 unrouted)
N$16  (2 unrouted)
N$17  (3 unrouted)
N$18  (2 unrouted)
N$19  (2 unrouted)
N$20  (3 unrouted)
N$21  (2 unrouted)
N$22  (3 unrouted)
N$23  (2 unrouted)
N$24  (3 unrouted)
N$25  (2 unrouted)
N$26  (3 unrouted)
N$27  (2 unrouted)
N$28  (3 unrouted)
N$29  (2 unrouted)
N$30  (3 unrouted)
N$31  (2 unrouted)
N$32  (3 unrouted)
N$33  (2 unrouted)
N$34  (3 unrouted)
N$35  (2 unrouted)
N$36  (3 unrouted)
N$37  (2 unrouted)
N$38  (3 unrouted)
N$39  (2 unrouted)
N$40  (3 unrouted)
N$41  (2 unrouted)
N$42  (3 unrouted)
N$43  (2 unrouted)
N$44  (3 unrouted)
N$45  (2 unrouted)
N$46  (3 unrouted)
N$47  (2 unrouted)
N$48  (3 unrouted)
N$49  (2 unrouted)
N$50  (3 unrouted)
N$51  (2 unrouted)
N$52  (3 unrouted)
N$53  (2 unrouted)
N$54  (3 unrouted)
N$55  (3 unrouted)
N$56  (2 unrouted)
N$57  (3 unrouted)
N$58  (2 unrouted)
N$59  (3 unrouted)
N$60  (2 unrouted)
N$61  (3 unrouted)
N$62  (2 unrouted)
N$63  (3 unrouted)
N$64  (2 unrouted)
N$65  (3 unrouted)
N$66  (2 unrouted)
N$67  (3 unrouted)
N$68  (2 unrouted)
N$69  (3 unrouted)
N$70  (2 unrouted)
N$71  (3 unrouted)
N$72  (2 unrouted)
N$73  (1 unrouted)
N$74  (1 unrouted)
N$75  (1 unrouted)
N$76  (1 unrouted)
N$77  (2 unrouted)
N$78  (2 unrouted)
N$79  (1 unrouted)
N$80  (1 unrouted)
N$81  (3 unrouted)
N$82  (3 unrouted)
N$83  (3 unrouted)
N$84  (3 unrouted)
N$85  (3 unrouted)
N$86  (3 unrouted)
N$87  (3 unrouted)
N$88  (3 unrouted)
N$89  (3 unrouted)
N$90  (3 unrouted)
N$91  (3 unrouted)
N$92  (3 unrouted)
N$93  (3 unrouted)
N$94  (3 unrouted)
N$95  (3 unrouted)
N$96  (3 unrouted)
N$97  (3 unrouted)
N$98  (3 unrouted)
N$99  (3 unrouted)
N$100  (3 unrouted)
N$101  (3 unrouted)
N$102  (3 unrouted)
N$103  (3 unrouted)
N$104  (3 unrouted)
N$105  (3 unrouted)
N$106  (3 unrouted)
N$107  (3 unrouted)
N$108  (3 unrouted)
N$109  (3 unrouted)
N$110  (3 unrouted)
VCC  (1 unrouted)
VPP  (31 unrouted)
VSS  (29 unrouted)

### Text on the board
tPlace: BV | BA | AV | AA | M/R Series Flip-Chip Tester Loads